# EAGLE design 4channelsRelay (EAGLE 6.1)
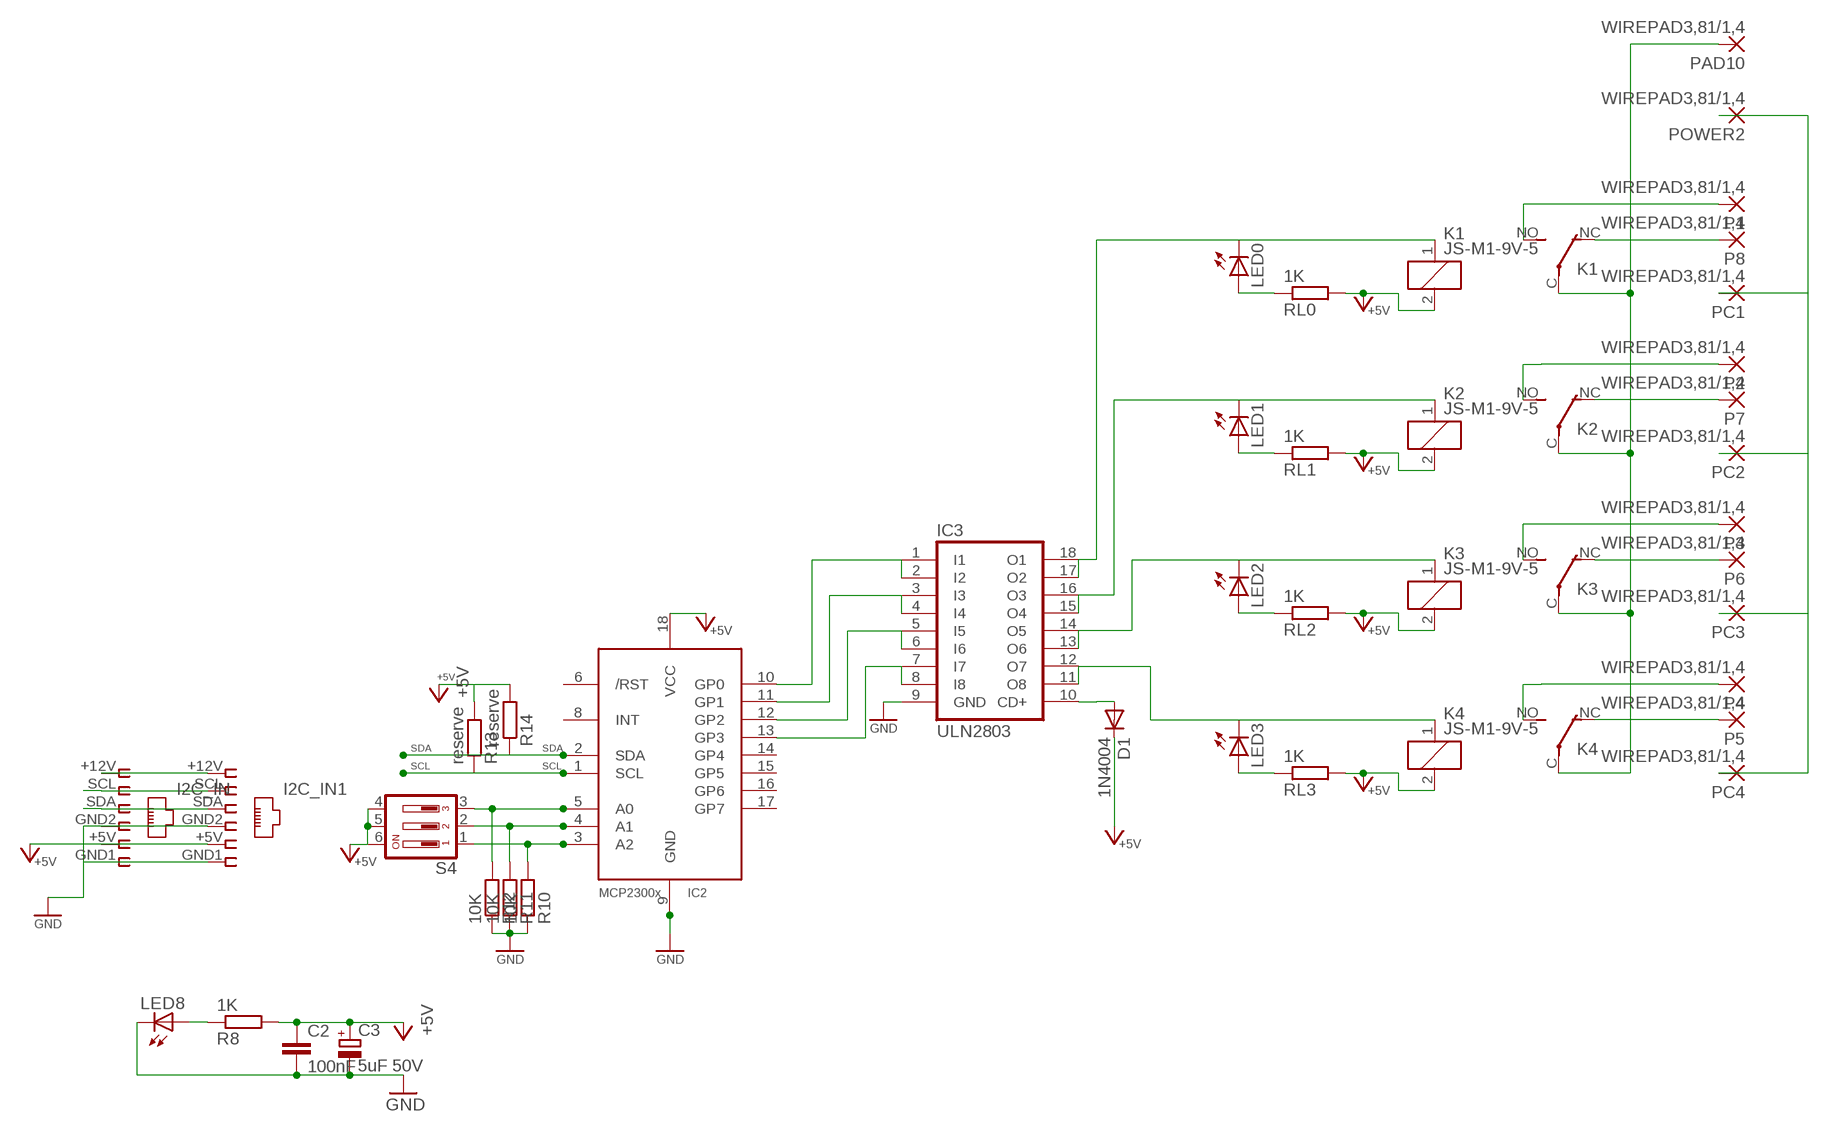
[diagram p0: schematic, sheet 1]

## Parts
C2  100nF  C-EUC1206  [C1206]
C3  5uF 50V  CPOL-EUE3.5-8  [E3,5-8]
D1  1N4004  [DO41-10]
I2C_IN  I2C 1  RJ12STRAIGHT-I2C  [RJ12-STRAIGHT-I2C]
I2C_IN1  I2C 2  RJ12STRAIGHT-I2C  [RJ12-STRAIGHT-I2C]
IC2  MCP2300X/P  [DIL18]
IC3  ULN2803  ULN2803A  [DIL18]
K1  JS-M1-9V-5  [JS-M]
K2  JS-M1-9V-5  [JS-M]
K3  JS-M1-9V-5  [JS-M]
K4  JS-M1-9V-5  [JS-M]
LED0  LED3MM  [LED3MM]
LED1  LED3MM  [LED3MM]
LED2  LED3MM  [LED3MM]
LED3  LED3MM  [LED3MM]
LED8  LED3MM  [LED3MM]
P1  WIREPAD3,81/1,4  [3,81/1,4]
P2  WIREPAD3,81/1,4  [3,81/1,4]
P3  WIREPAD3,81/1,4  [3,81/1,4]
P4  WIREPAD3,81/1,4  [3,81/1,4]
P5  WIREPAD3,81/1,4  [3,81/1,4]
P6  WIREPAD3,81/1,4  [3,81/1,4]
P7  WIREPAD3,81/1,4  [3,81/1,4]
P8  WIREPAD3,81/1,4  [3,81/1,4]
PAD10  WIREPAD3,81/1,4  [3,81/1,4]
PC1  WIREPAD3,81/1,4  [3,81/1,4]
PC2  WIREPAD3,81/1,4  [3,81/1,4]
PC3  WIREPAD3,81/1,4  [3,81/1,4]
PC4  WIREPAD3,81/1,4  [3,81/1,4]
POWER2  WIREPAD3,81/1,4  [3,81/1,4]
R8  1K  R-EU_M1206  [M1206]
R10  10K  R-EU_M1206  [M1206]
R11  10K  R-EU_M1206  [M1206]
R12  10K  R-EU_M1206  [M1206]
R13  reserve  R-EU_M1206  [M1206]
R14  reserve  R-EU_M1206  [M1206]
RL0  1K  R-EU_M1206  [M1206]
RL1  1K  R-EU_M1206  [M1206]
RL2  1K  R-EU_M1206  [M1206]
RL3  1K  R-EU_M1206  [M1206]
S4  DIP03YL  [DIP03YL]

## Nets
+5V [highpower]: C2.1 C3.+ D1.C I2C_IN1.+5V I2C_IN.+5V IC2.18(VCC) K1.2 K2.2 K3.2 K4.2 R8.2 R13.2 R14.2 RL0.2 RL1.2 RL2.2 RL3.2 S4.4 S4.5 S4.6
CD+: D1.A IC3.10(CD+)
GND [highpower]: C2.2 C3.- I2C_IN1.GND1 I2C_IN1.GND2 I2C_IN.GND1 I2C_IN.GND2 IC2.9(GND) IC3.9(GND) LED8.K(C) R10.1 R11.1 R12.1
N$1 [power]: IC3.15(O4) IC3.16(O3) K2.1 LED1.K(C)
N$2: LED0.A RL0.1
N$3 [power]: IC3.17(O2) IC3.18(O1) K1.1 LED0.K(C)
N$4: LED1.A RL1.1
N$5 [highpower]: I2C_IN1.+12V I2C_IN.+12V
N$6 [highpower]: K1.NC(2:O) P8.1(P)
N$7 [highpower]: K2.NC(2:O) P7.1(P)
N$8 [highpower]: K4.NO(2:S) P4.1(P)
N$9 [power]: IC3.11(O8) IC3.12(O7) K4.1 LED3.K(C)
N$10 [highpower]: K3.NC(2:O) P6.1(P)
N$11 [highpower]: K3.NO(2:S) P3.1(P)
N$12 [highpower]: PC1.1(P) PC2.1(P) PC3.1(P) PC4.1(P) POWER2.1(P)
N$13 [highpower]: K4.NC(2:O) P5.1(P)
N$14 [highpower]: K2.NO(2:S) P2.1(P)
N$16: IC2.5(A0) R12.2 S4.3
N$17: IC2.4(A1) R11.2 S4.2
N$18: IC2.3(A2) R10.2 S4.1
N$19 [highpower]: K1.NO(2:S) P1.1(P)
N$23: LED8.A R8.1
N$38: LED2.A RL2.1
N$40 [power]: IC3.13(O6) IC3.14(O5) K3.1 LED2.K(C)
N$41: LED3.A RL3.1
P0: IC2.10(GP0) IC3.1(I1) IC3.2(I2)
P1: IC2.11(GP1) IC3.3(I3) IC3.4(I4)
P2: IC2.12(GP2) IC3.5(I5) IC3.6(I6)
P3: IC2.13(GP3) IC3.7(I7) IC3.8(I8)
POWER1 [highpower]: K1.C(2:P) K2.C(2:P) K3.C(2:P) K4.C(2:P) PAD10.1(P)
SCL: I2C_IN1.SCL I2C_IN.SCL IC2.1(SCL) R13.1
SDA: I2C_IN1.SDA I2C_IN.SDA IC2.2(SDA) R14.1
Unconnected: IC2.6(/RST) IC2.8(INT) IC2.14(GP4) IC2.15(GP5) IC2.16(GP6) IC2.17(GP7)

## Library data of the parts
C2 = rcl:C-EU: CAPACITOR, European symbol
C3 = rcl:CPOL-EU: POLARIZED CAPACITOR, European symbol
D1 = diode:1N4004: DIODE general purpose rectifier, 1 A
I2C_IN I2C_IN1 = lpatiny:RJ12: CORCOM Modular RJ Jacks No Shield Source: www.tycoelectronics.com .. ENG_DS_1654001_1099_RJ_L_0507.pdf
IC2 = adafruit:MCP2300X: MCP23008 Inexpensive i2c i/o expander - 8 general purpose i/o pins with optional pullups
IC3 = uln-udn:ULN2803A: DRIVER ARRAY
K1-K4 = relay:JS-M1*: Automotive Ultra-Miniature Power Relay NAiS Source: http://www.mew-europe.com/.. en_ds_61211_0000.pdf; OC_FARNELL: unknown; OC_NEWARK: unknown
LED0 LED1-LED3 LED8 = lpatiny:LED3MM
P1-P8 PAD10 PC1-PC4 POWER2 = wirepad:WIREPAD: Wire PAD connect wire on PCB
R8 R10-R14 RL0 RL1-RL3 = resistor:R-EU_: RESISTOR, European symbol
S4 = switch-dil:DIP03YL: DIL/CODE SWITCH; OC_FARNELL: unknown; OC_NEWARK: unknown

## Net classes
0 default: width 0.457 mm
1 power: width 0.914 mm
2 highpower: width 1.372 mm

## Board
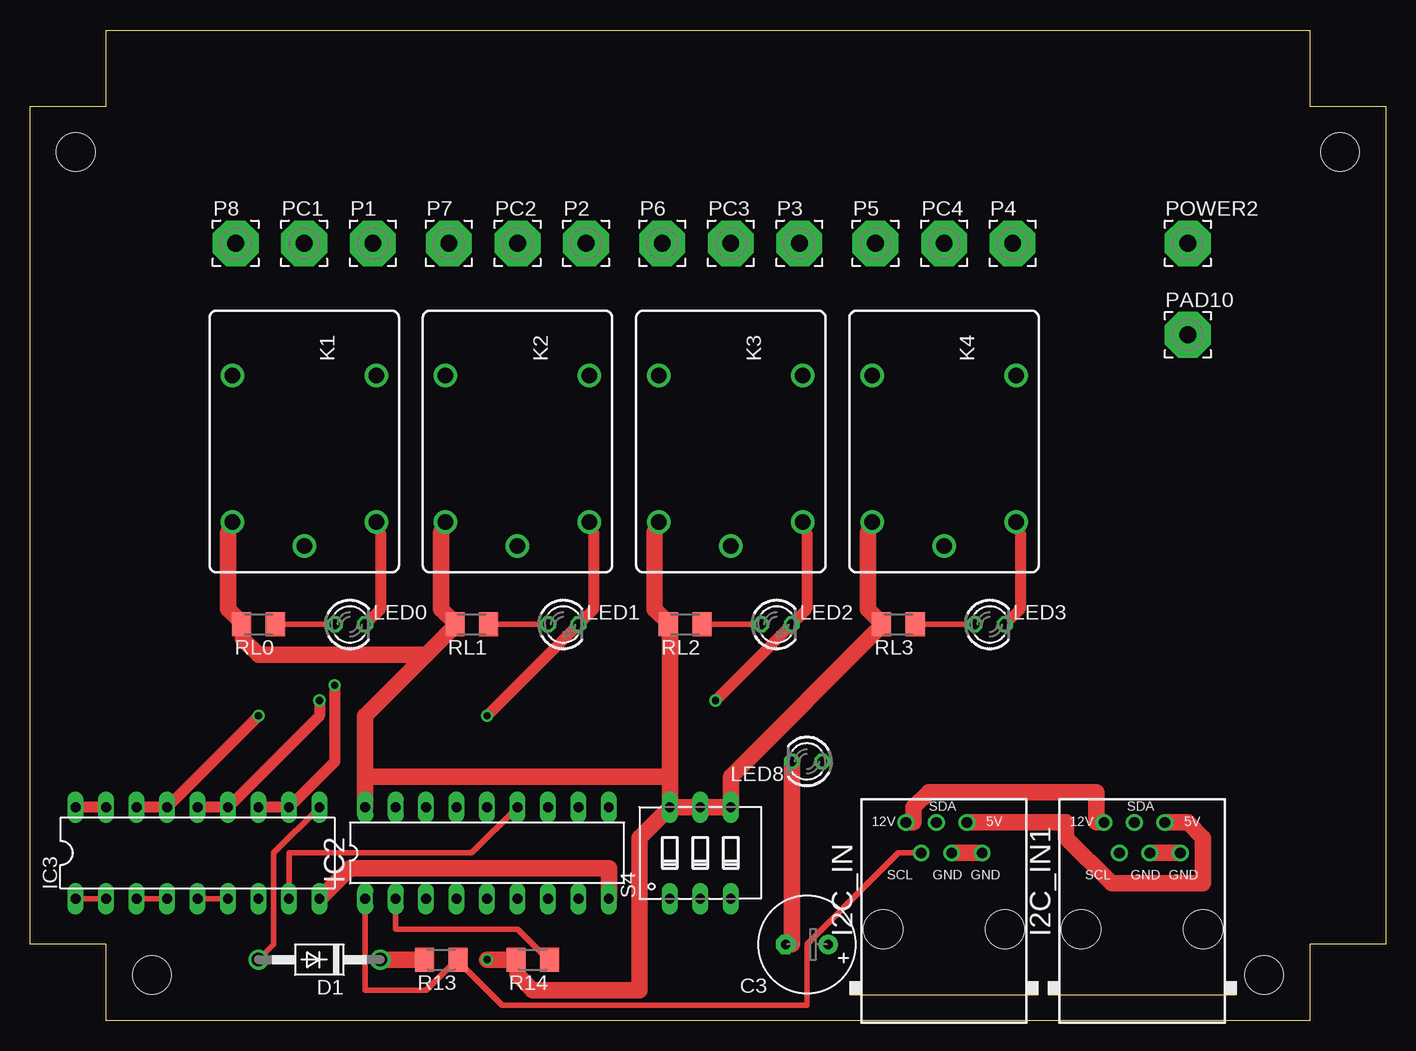
[diagram p1: board, top side]
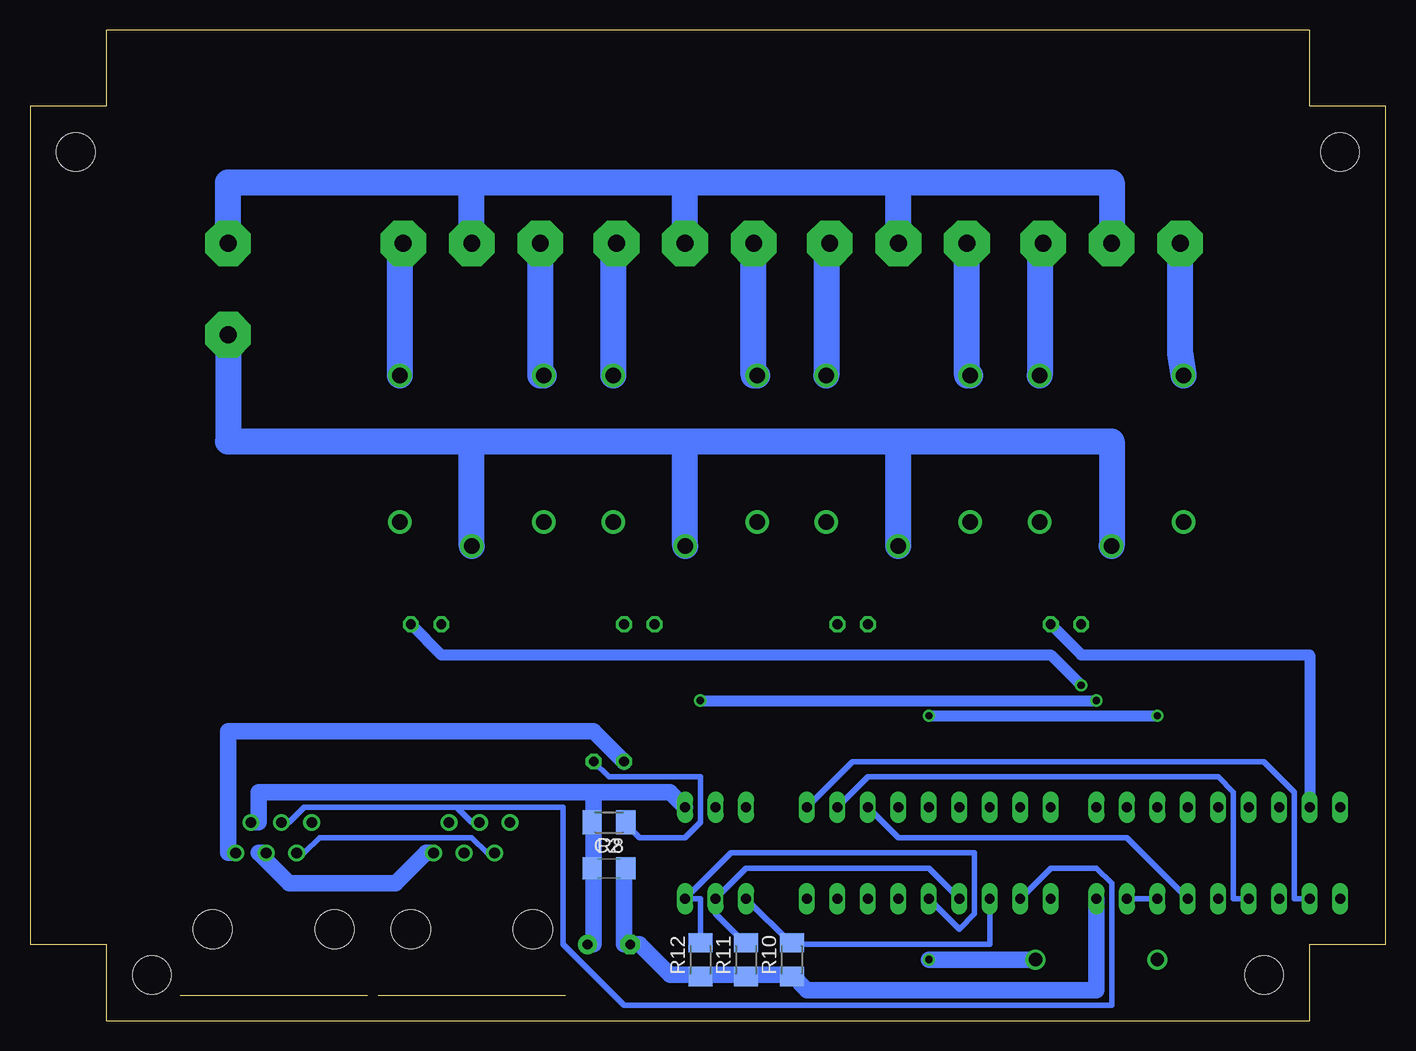
[diagram p2: board, bottom side, seen from below]

Size 113.03 x 82.55 mm. Coordinates in mm from the lower left corner, seen from the top.
Outline: 0,76.2 6.35,76.2 6.35,82.55 106.68,82.55 106.68,76.2 113.03,76.2 113.03,6.35 106.68,6.35 106.68,0 6.35,0 6.35,6.35 0,6.35 0,76.2
Copper layers (1*16): Top 0.035mm / dielectric 1.5mm / Bottom 0.035mm
Design rules: minimum track width 10mil, minimum drill 24mil, track to track 8mil, track to pad 8mil, pad to pad 8mil, via to via 8mil, smd to smd 8mil, copper to edge 40mil, drill to drill 8mil, minimum pad ring 10mil, minimum via ring 8mil, stop-mask expansion 4mil, vias tented up to drill 0mil, thermal gap 10mil
Holes 3.2 mm at 3.81,72.39 10.16,3.81 102.87,3.81 109.22,72.39
tRestrict: area 5.1,41.9 to 92.7,49.5; area 36.8,35.6 to 44.5,43.2; area 54.6,35.6 to 62.2,43.2; area 72.4,35.6 to 80,43.2; area 19.1,35.6 to 26.7,43.2
bRestrict: area 5.1,41.9 to 92.7,49.5; area 19.1,35.6 to 26.7,43.2; area 36.8,35.6 to 44.5,43.2; area 54.6,35.6 to 62.2,43.2; area 72.4,35.6 to 80,43.2
Milling: 12 lines

### Footprints (pad centres in the part's own frame; a part is rotated, then mirrored left to right if it is on the bottom)
C1206 = smd 1.6 x 1.8: 1 -1.4,0; 2 1.4,0
E3,5-8 = drill 0.813 pad 1.6: + -1.778,0 | drill 0.813 pad 1.6 octagon: - 1.778,0
DO41-10 = drill 1.118: A 5.08,0; C -5.08,0
RJ12-STRAIGHT-I2C = drill 0.9 pad 1.4: +5V 1.905,8.89; +12V -3.175,8.89; GND1 3.175,6.35; GND2 0.635,6.35; SCL -1.905,6.35; SDA -0.635,8.89 | hole 3.251: -5.08,0; 5.08,0
DIL18 = drill 0.813 long: 1 -10.16,-3.81; 2 -7.62,-3.81; 3 -5.08,-3.81; 4 -2.54,-3.81; 5 0,-3.81; 6 2.54,-3.81; 7 5.08,-3.81; 8 7.62,-3.81; 9 10.16,-3.81; 10 10.16,3.81; 11 7.62,3.81; 12 5.08,3.81; 13 2.54,3.81; 14 0,3.81; 15 -2.54,3.81; 16 -5.08,3.81; 17 -7.62,3.81; 18 -10.16,3.81
JS-M = drill 1.3: 1 6.7,6; 2 6.7,-6; C 8.7,0; NC -5.5,-6; NO -5.5,6
LED3MM = drill 0.813 octagon: A -1.27,0; K 1.27,0
3,81/1,4 = drill 1.397 pad 3.81 octagon: 1 0,0
M1206 = smd 1.6 x 2: 1 -1.4,0; 2 1.4,0
DIP03YL = drill 0.813 long: 1 -2.54,-3.81; 2 0,-3.81; 3 2.54,-3.81; 4 2.54,3.81; 5 0,3.81; 6 -2.54,3.81

### Placement (x,y rotation side)
C2  64.77,12.7 0 bottom
C3  64.77,6.35 180 top
D1  24.13,5.08 180 top
I2C_IN  76.2,7.62 0 top
I2C_IN1  92.71,7.62 0 top
IC2  38.1,13.97 0 top
IC3  13.97,13.97 0 top
K1  22.86,48.26 270 top
K2  40.64,48.26 270 top
K3  58.42,48.26 270 top
K4  76.2,48.26 270 top
LED0  26.67,33.02 0 top
LED1  44.45,33.02 0 top
LED2  62.23,33.02 0 top
LED3  80.01,33.02 0 top
LED8  64.77,21.59 180 top
P1  28.57,64.77 0 top
P2  46.36,64.77 0 top
P3  64.14,64.77 0 top
P4  81.91,64.77 0 top
P5  70.48,64.77 0 top
P6  52.71,64.77 0 top
P7  34.93,64.77 0 top
P8  17.14,64.77 0 top
PAD10  96.52,57.15 0 top
PC1  22.86,64.77 0 top
PC2  40.64,64.77 0 top
PC3  58.42,64.77 0 top
PC4  76.2,64.77 0 top
POWER2  96.52,64.77 0 top
R8  64.77,16.51 180 bottom
R10  49.53,5.08 90 bottom
R11  53.34,5.08 90 bottom
R12  57.15,5.08 90 bottom
R13  34.29,5.08 180 top
R14  41.91,5.08 180 top
RL0  19.05,33.02 180 top
RL1  36.83,33.02 180 top
RL2  54.61,33.02 180 top
RL3  72.39,33.02 180 top
S4  55.88,13.97 0 top

### Tracks (layer width: path | path; a pad name or v marks a point on that pad's centre or on a via)
+5V  (via drill 0.61)
  Top 1.372: 17.78,33.02 16.51,34.29 16.51,40.64 K1.2 | 35.56,33.02 34.29,34.29 34.29,40.64 K2.2 | 27.94,20.32 27.94,25.4 33.02,30.48 | 27.94,20.32 IC2.18 | 35.56,33.02 33.02,30.48 | 35.56,33.02 RL1.2 | 17.78,33.02 17.78,31.75 19.05,30.48 33.02,30.48 | 17.78,33.02 RL0.2 | I2C_IN.+5V 86.36,16.51 86.36,15.24 90.17,11.43 97.79,11.43 97.79,15.24 96.52,16.51 I2C_IN1.+5V | 71.12,33.02 69.85,34.29 69.85,40.64 K4.2 | 53.34,33.02 52.07,34.29 52.07,40.64 K3.2 | D1.C R13.2 33.02,5.08 | S4.6 50.8,15.24 50.8,2.54 41.91,2.54 40.64,3.81 40.64,5.08 R14.2 v38.1,5.08 | S4.6 S4.5 S4.4 58.42,20.32 71.12,33.02 | S4.6 53.34,20.32 | 53.34,20.32 53.34,33.02 | 53.34,33.02 RL2.2 | 71.12,33.02 RL3.2 | 53.34,20.32 27.94,20.32
  Bottom 1.372: 66.04,16.51 66.04,12.7 | 66.04,12.7 66.04,6.35 C3.+ | 66.04,12.7 C2.1 | v38.1,5.08 D1.C | 66.04,19.05 66.04,16.51 | 66.04,19.05 59.69,19.05 S4.4 | 66.04,16.51 R8.2 | 66.04,19.05 93.98,19.05 93.98,16.51 I2C_IN1.+5V
CD+
  Top 0.457: IC3.10 20.32,13.97 20.32,6.35 D1.A
GND
  Top 1.372: IC3.9 26.67,12.7 48.26,12.7 IC2.9 | I2C_IN.GND1 I2C_IN.GND2 | I2C_IN1.GND1 I2C_IN1.GND2 | LED8.K 63.5,6.35 C3.-
  Bottom 1.372: I2C_IN.GND1 80.01,13.97 82.55,11.43 91.44,11.43 93.98,13.97 I2C_IN1.GND2 | 53.34,3.81 49.53,3.81 | 53.34,3.81 57.15,3.81 | 53.34,3.81 R11.1 | C2.2 63.5,12.7 63.5,6.35 C3.- 62.23,6.35 59.69,3.81 57.15,3.81 | 57.15,3.81 R12.1 | LED8.K 66.04,24.13 96.52,24.13 96.52,13.97 I2C_IN1.GND1 | IC3.9 24.13,2.54 48.26,2.54 49.53,3.81 | 49.53,3.81 R10.1
N$1  (via drill 0.61)
  Top 0.914: IC3.16 IC3.15 v19.05,25.4 | K2.1 46.99,40.64 46.99,34.29 LED1.K v38.1,25.4
  Bottom 0.914: v38.1,25.4 v19.05,25.4
N$2
  Top 0.457: LED0.A RL0.1 20.32,33.02
N$3
  Top 0.914: IC3.17 IC3.18 | LED0.K 29.21,34.29 29.21,40.64 K1.1
  Bottom 0.914: IC3.17 6.35,30.48 25.4,30.48 LED0.K
N$4
  Top 0.457: LED1.A RL1.1 38.1,33.02
N$5
  Top 1.372: I2C_IN.+12V 73.66,16.51 73.66,17.78 74.93,19.05 88.9,19.05 88.9,16.51 I2C_IN1.+12V
N$6
  Bottom 2.184: K1.NC 17.14,55.66 P8.1
N$7
  Bottom 2.184: K2.NC 34.93,53.76 P7.1
N$8
  Bottom 2.184: P4.1 82.2,64.77 K4.NO
N$9  (via drill 0.61)
  Top 0.914: IC3.12 IC3.11 25.4,21.59 v25.4,27.94 | LED3.K 82.55,34.29 82.55,40.64 K4.1
  Bottom 0.914: v25.4,27.94 27.94,30.48 78.74,30.48 LED3.K
N$10
  Bottom 2.184: K3.NC 52.71,53.76 P6.1
N$11
  Bottom 2.184: P3.1 64.42,64.77 K3.NO
N$12
  Bottom 2.184: POWER2.1 96.52,69.85 76.2,69.85 | PC4.1 76.2,69.85 | 76.2,69.85 58.42,69.85 | PC3.1 58.42,69.85 | 58.42,69.85 40.64,69.85 | PC2.1 40.64,69.85 | 40.64,69.85 22.86,69.85 PC1.1
N$13
  Bottom 2.184: K4.NC 70.48,53.76 P5.1
N$14
  Bottom 2.184: P2.1 46.64,64.77 K2.NO
N$16
  Bottom 0.457: 57.15,6.35 R12.2 57.15,10.16 S4.3 54.61,13.97 34.29,13.97 34.29,8.89 35.56,7.62 IC2.5
N$17
  Bottom 0.457: R11.2 53.34,6.35 55.88,8.89 S4.2 53.34,12.7 38.1,12.7 IC2.4
N$18
  Bottom 0.457: S4.1 49.53,6.35 | IC2.3 33.02,6.35 49.53,6.35 | 49.53,6.35 R10.2
N$19
  Bottom 2.184: P1.1 28.86,64.77 K1.NO
N$23
  Bottom 0.457: LED8.A 64.77,20.32 57.15,20.32 57.15,16.51 58.42,15.24 62.23,15.24 63.5,16.51 R8.1
N$38
  Top 0.457: LED2.A RL2.1 55.88,33.02
N$40  (via drill 0.61)
  Top 0.914: IC3.14 IC3.13 24.13,25.4 v24.13,26.67 | K3.1 64.77,40.64 64.77,34.29 LED2.K v57.15,26.67
  Bottom 0.914: v57.15,26.67 v24.13,26.67
N$41
  Top 0.457: LED3.A RL3.1 73.66,33.02
P0
  Top 0.457: IC3.2 IC3.1
  Bottom 0.457: IC2.10 44.45,21.59 10.16,21.59 7.62,19.05 7.62,10.16 IC3.2
P1
  Top 0.457: IC3.4 IC3.3
  Bottom 0.457: IC2.11 43.18,20.32 13.97,20.32 12.7,19.05 12.7,10.16 IC3.4
P2
  Top 0.457: IC3.6 IC3.5
  Bottom 0.457: IC2.12 40.64,15.24 21.59,15.24 IC3.6
P3
  Top 0.457: IC2.13 36.83,13.97 21.59,13.97 IC3.8
  Bottom 0.457: IC3.8 IC3.7
POWER1
  Bottom 2.184: PAD10.1 96.52,48.26 76.2,48.26 | K4.C 76.2,48.26 | 76.2,48.26 58.42,48.26 | K3.C 58.42,48.26 | 58.42,48.26 40.64,48.26 | K2.C 40.64,48.26 | 40.64,48.26 22.86,48.26 K1.C
SCL
  Top 0.457: 35.56,5.08 33.02,2.54 27.94,2.54 IC2.1 | 35.56,5.08 39.37,1.27 64.77,1.27 64.77,6.35 72.39,13.97 I2C_IN.SCL | 35.56,5.08 R13.1
  Bottom 0.457: I2C_IN.SCL 74.93,13.97 76.2,15.24 88.9,15.24 90.17,13.97 I2C_IN1.SCL
SDA
  Top 0.457: IC2.2 30.48,7.62 40.64,7.62 43.18,5.08 R14.1
  Bottom 0.457: 77.47,17.78 76.2,16.51 I2C_IN.SDA | 77.47,17.78 90.17,17.78 91.44,16.51 I2C_IN1.SDA | IC2.2 27.94,12.7 24.13,12.7 22.86,11.43 22.86,1.27 63.5,1.27 68.58,6.35 68.58,17.78 77.47,17.78